# Altium schematic sheet D1.SchDoc
size A
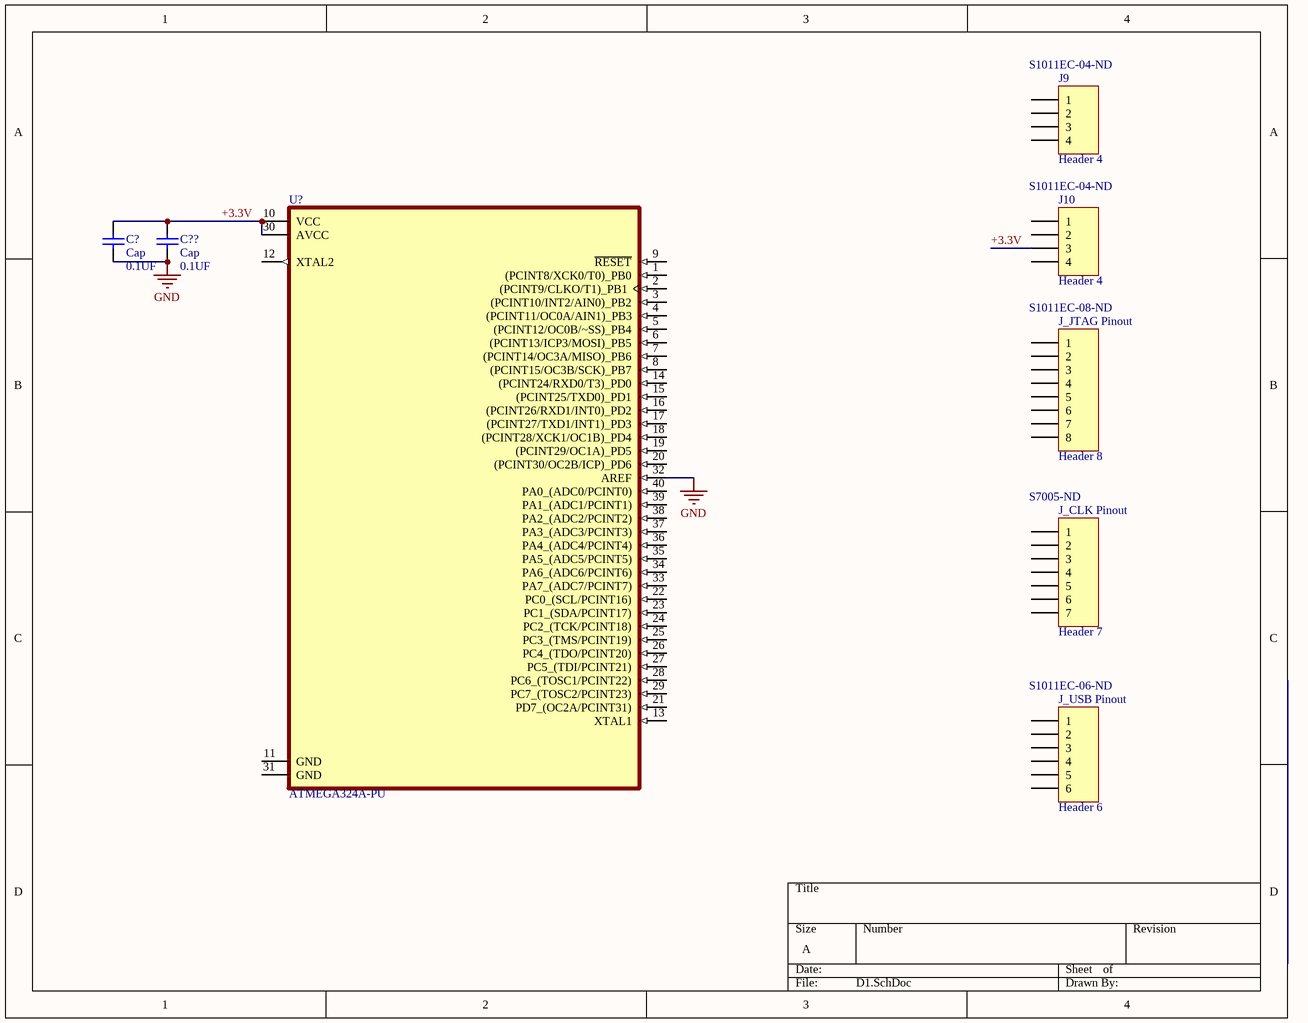
[diagram p0: D1.SchDoc]

## Parts
C?  Cap  value 0.1UF  [1812]
C??  Cap  value 0.1UF  [1812]
J9  Header 4  Supplier Part Number 1: S1011EC-04-ND  [HDR1X4]
J10  Header 4  Supplier Part Number 1: S1011EC-04-ND  [HDR1X4]
J_CLK_Pinout  Header 7  Supplier Part Number 1: S7005-ND  [HDR1X7]
J_JTAG_Pinout  Header 8  Supplier Part Number 1: S1011EC-08-ND  [HDR1X8]
J_USB_Pinout  Header 6  Supplier Part Number 1: S1011EC-06-ND  [HDR1X6]
U?  ATMEGA324A-PU  [40-DIP (0.600", 15.24mm)]

## Nets
GND: C?.1 C??.1 U?.32(AREF)
+3.3V: C?.2 C??.2 J10.3 U?.10(VCC) U?.30(AVCC)

Not connected (* = marked no-connect by the designer): J9 1 2 3 4; J10 1 2 4; J_CLK_Pinout 1 2 3 4 5 6 7; J_JTAG_Pinout 1 2 3 4 5 6 7 8; J_USB_Pinout 1 2 3 4 5 6; U? 1((PCINT8/XCK0/T0)_PB0) 2((PCINT9/CLKO/T1)_PB1) 3((PCINT10/INT2/AIN0)_PB2) 4((PCINT11/OC0A/AIN1)_PB3) 5((PCINT12/OC0B/~SS)_PB4) 6((PCINT13/ICP3/MOSI)_PB5) 7((PCINT14/OC3A/MISO)_PB6) 8((PCINT15/OC3B/SCK)_PB7) 9(~{RESET}) 11(GND) 12(XTAL2) 13(XTAL1) 14((PCINT24/RXD0/T3)_PD0) 15((PCINT25/TXD0)_PD1) 16((PCINT26/RXD1/INT0)_PD2) 17((PCINT27/TXD1/INT1)_PD3) 18((PCINT28/XCK1/OC1B)_PD4) 19((PCINT29/OC1A)_PD5) 20((PCINT30/OC2B/ICP)_PD6) 21(PD7_(OC2A/PCINT31)) 22(PC0_(SCL/PCINT16)) 23(PC1_(SDA/PCINT17)) 24(PC2_(TCK/PCINT18)) 25(PC3_(TMS/PCINT19)) 26(PC4_(TDO/PCINT20)) 27(PC5_(TDI/PCINT21)) 28(PC6_(TOSC1/PCINT22)) 29(PC7_(TOSC2/PCINT23)) 31(GND) 33(PA7_(ADC7/PCINT7)) 34(PA6_(ADC6/PCINT6)) 35(PA5_(ADC5/PCINT5)) 36(PA4_(ADC4/PCINT4)) 37(PA3_(ADC3/PCINT3)) 38(PA2_(ADC2/PCINT2)) 39(PA1_(ADC1/PCINT1)) 40(PA0_(ADC0/PCINT0))

## Library data of the parts
C? C?? = CAP CER 0.1UF 50V X7R 1812: Capacitor; Manufacturer Part Number: 885012210025; Designator: C?; Voltage Rating: 50V; Published: 8-Jun-2000; LatestRevisionDate: 17-Jul-2002; LatestRevisionNote: Re-released for DXP Platform.; Publisher: Altium Limited
J9 J10 = Header 4: Conn Header Vert 4POS 2.54MM; Manufacturer: Sullins; Manufacturer Part Number: PRPC004SAAN-RC; Number of Positions: 4; Connector Type: Male Pin; Pitch: 0.1inch; LatestRevisionDate: 17-Jul-2002; LatestRevisionNote: Re-released for DXP Platform.; Publisher: Altium Limited; Supplier 1: Digi-Key; RoHS: Yes; Category: Connectors; Stock 1: 11663; Pricing 1: 1=0.15000, 10=0.14600, 25=0.10840, 50=0.09280, 100=0.08980, 250=0.07740, 500=0.07430 (USD); Mount: Through Hole; Color: Black; Contact Plating: Gold; Package Quantity: 1; Number of Rows: 1; Packaging: Bulk; Termination: Solder; Series: -; Contact Type: Male Pin; Contact Mating Length: 0.23inch; RoHS Compliant: Yes; ComponentLink1URL: https://datasheet.ciiva.com/741/xrxczzzsxxn-rc-st-11635-b-741241.pdf?src-supplier=Digi-Key; ComponentLink1Description: https://datasheet.ciiva.com/741/xrxczzzsxxn-rc-st-11635-b-741241.pdf?src-supplier=Digi-Key
J_CLK_Pinout = Header 7: Female, 7C, Straight, .100"CC; 3.20mm Tail, No Mt. 100u" Tin; PBT, Phos Bronze, 105 C; Manufacturer: Sullins; Manufacturer Part Number: PPTC071LFBN-RC; Number of Positions: 7; Pitch: 0.1inch; LatestRevisionDate: 17-Jul-2002; LatestRevisionNote: Re-released for DXP Platform.; Publisher: Altium Limited; Supplier 1: Digi-Key; RoHS: Yes; Category: Connectors; Stock 1: 31167; Pricing 1: 1=0.59000, 10=0.51500, 80=0.42438, 440=0.36900, 1000=0.30442, 5000=0.26752, 10000=0.26650 (USD); Mount: Through Hole; Color: Black; Contact Plating: Tin; Contact Material: Bronze; Housing Material: Plastic; Package Quantity: 1000; Number of Rows: 1; Packaging: Bulk; Termination: Solder; Connector Type: Header; Contact Type: Female Socket; Length: 18.3mm; Width: 2.5mm; Height: 8.5mm; Lead Free: Lead Free; ComponentLink1URL: https://media.digikey.com/pdf/Data%20Sheets/Sullins%20PDFs/Female_Headers.100_DS.pdf?src-supplier=Digi-Key; ComponentLink1Description: https://media.digikey.com/pdf/Data%20Sheets/Sullins%20PDFs/Female_Headers.100_DS.pdf?src-supplier=Digi-Key; ComponentLink2URL: http://www.sullinscorp.com/catalogs/78_Page80-81_HEADER_.100_2.54mm_FEMALE.pdf?src-supplier=Future+Electronics; ComponentLink2Description: http://www.sullinscorp.com/catalogs/78_Page80-81_HEADER_.100_2.54mm_FEMALE.pdf?src-supplier=Future+Electronics
J_JTAG_Pinout = Header 8: Conn Header Vert 8POS 2.54MM; Manufacturer: Sullins; Manufacturer Part Number: PRPC008SAAN-RC; Number of Positions: 8; Connector Type: Male Pin; Pitch: 0.1inch; LatestRevisionDate: 17-Jul-2002; LatestRevisionNote: Re-released for DXP Platform.; Publisher: Altium Limited; Supplier 1: Digi-Key; RoHS: Yes; Category: Connectors; Stock 1: 5110; Pricing 1: 1=0.25000, 10=0.23200, 25=0.19800, 50=0.17340, 100=0.16100, 250=0.14240, 500=0.13622 (USD); Mount: Through Hole; Color: Black; Contact Plating: Gold; Package Quantity: 1; Number of Rows: 1; Packaging: Bulk; Termination: Solder; Series: -; Contact Type: Male Pin; Contact Mating Length: 0.23inch; Lead Free: Lead Free; RoHS Compliant: Yes; ComponentLink1URL: https://datasheet.ciiva.com/741/xrxczzzsxxn-rc-st-11635-b-741237.pdf?src-supplier=Digi-Key; ComponentLink1Description: https://datasheet.ciiva.com/741/xrxczzzsxxn-rc-st-11635-b-741237.pdf?src-supplier=Digi-Key
J_USB_Pinout = Header 6: Conn Header .100" Sngl Str 6POS; Manufacturer: Sullins; Manufacturer Part Number: PRPC006SAAN-RC; Number of Positions: 6; Connector Type: Male Pin; Pitch: 0.1inch; LatestRevisionDate: 17-Jul-2002; LatestRevisionNote: Re-released for DXP Platform.; Publisher: Altium Limited; Supplier 1: Digi-Key; RoHS: Yes; Category: Connectors; Stock 1: 14553; Pricing 1: 1=0.19000, 10=0.17400, 25=0.14880, 50=0.13000, 100=0.12070, 250=0.10680, 500=0.10216 (USD); Mount: Through Hole; Color: Black; Contact Plating: Gold; Package Quantity: 1; Number of Rows: 1; Packaging: Bulk; Termination: Solder; Series: -; Contact Type: Male Pin; Contact Mating Length: 0.23inch; Lead Free: Lead Free; RoHS Compliant: Yes; ComponentLink1URL: https://datasheet.ciiva.com/741/xrxczzzsxxn-rc-st-11635-b-741239.pdf?src-supplier=Digi-Key; ComponentLink1Description: https://datasheet.ciiva.com/741/xrxczzzsxxn-rc-st-11635-b-741239.pdf?src-supplier=Digi-Key
U? = ATMEGA324A-PU: AVR series Microcontroller IC 8-Bit 20MHz 32KB (16K x 16) FLASH 40-PDIP; MF: Microchip Technology; Designator: U?; Package: PDIP-40 Microchip; SnapEDA_Link: https://www.snapeda.com/parts/ATMEGA324A-PU/Microchip/view-part/?ref=snap; Value: *; MP: ATMEGA324A-PU; Availability: In Stock; Price: None; Purchase-URL: https://pricing.snapeda.com/search/part/ATMEGA324A-PU/?ref=eda; Check_prices: https://www.snapeda.com/parts/ATMEGA324A-PU/Microchip/view-part/?ref=eda; Manufacturer Part Number: ATMEGA324A-PU